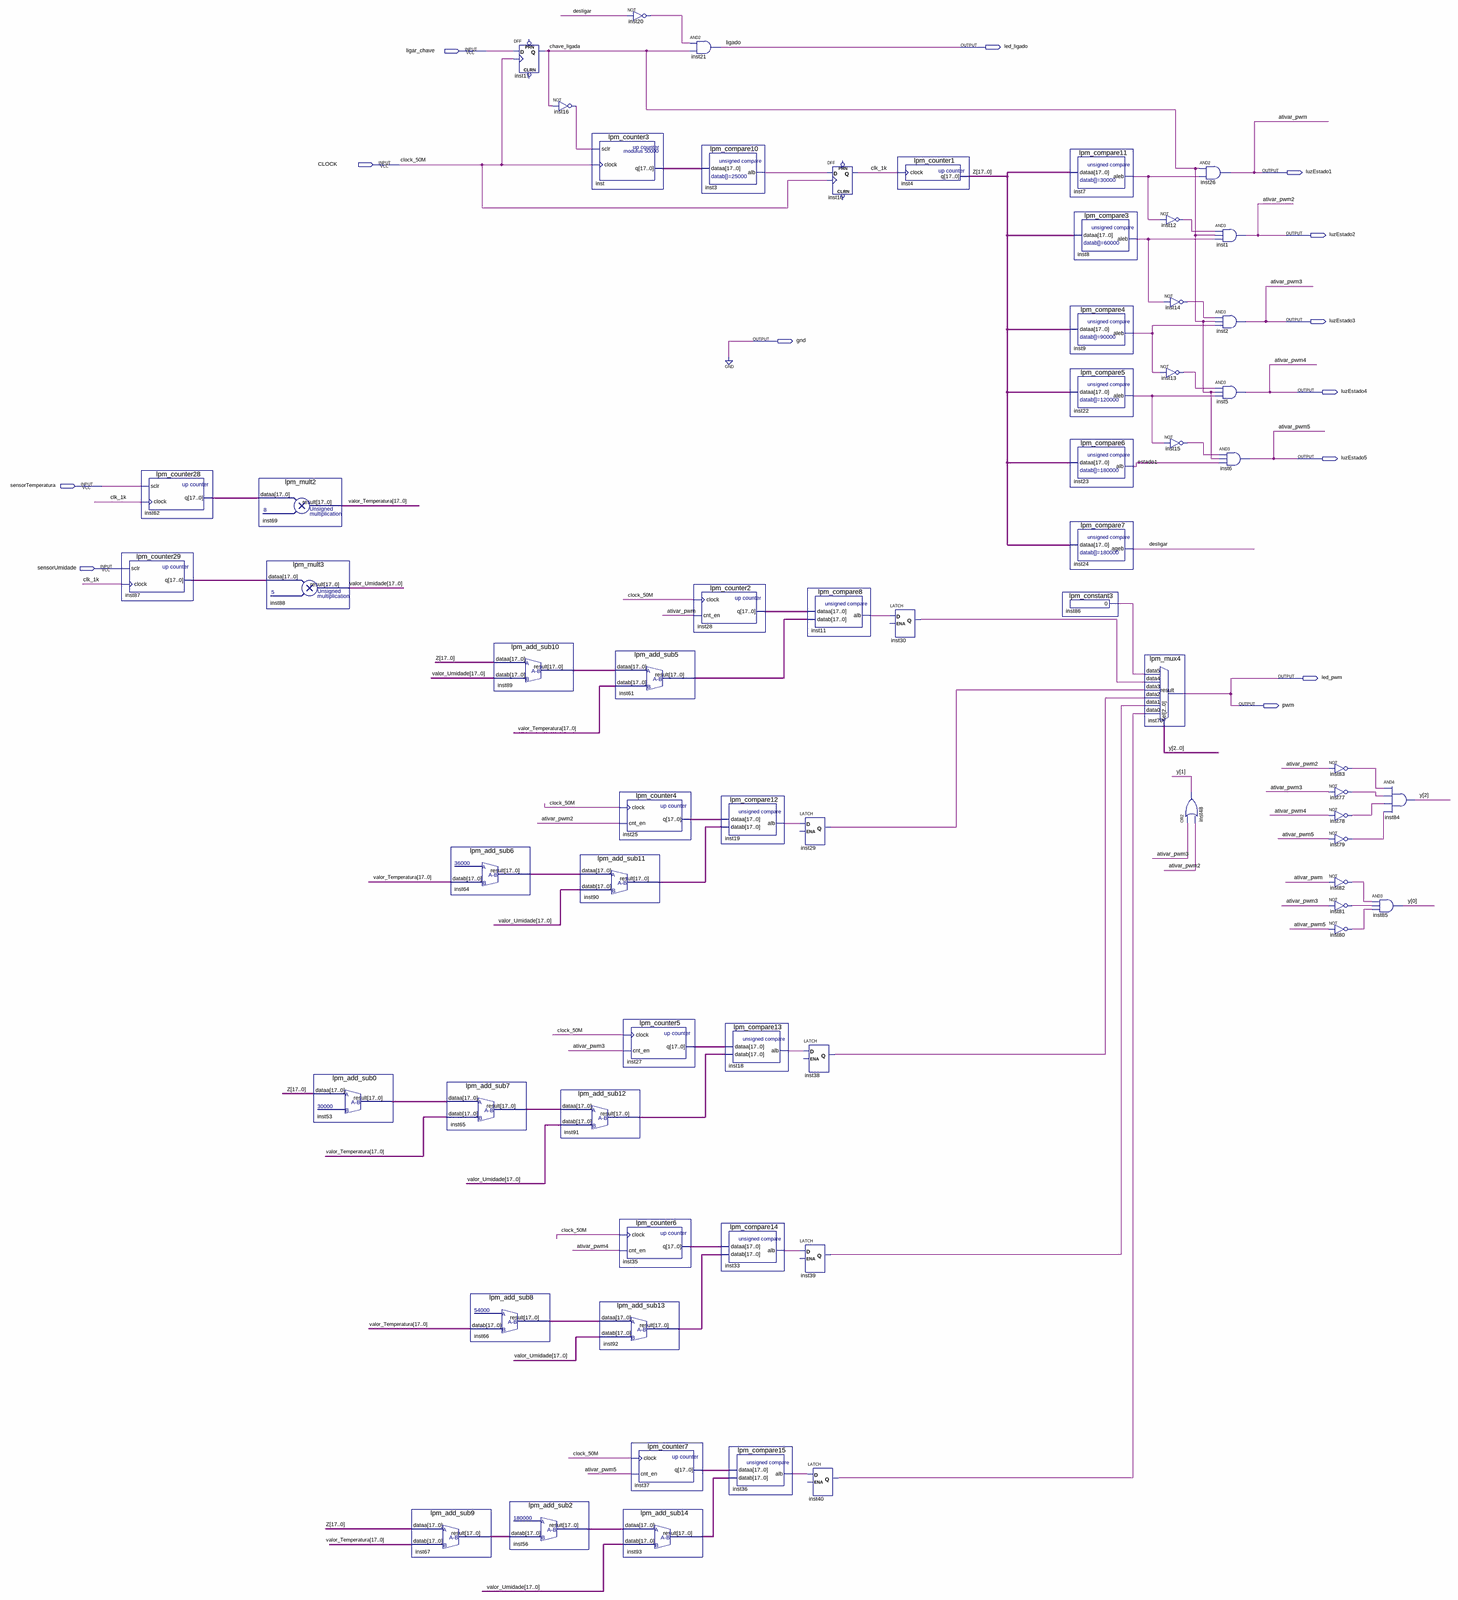
[diagram p0: schematic sheet, whole]
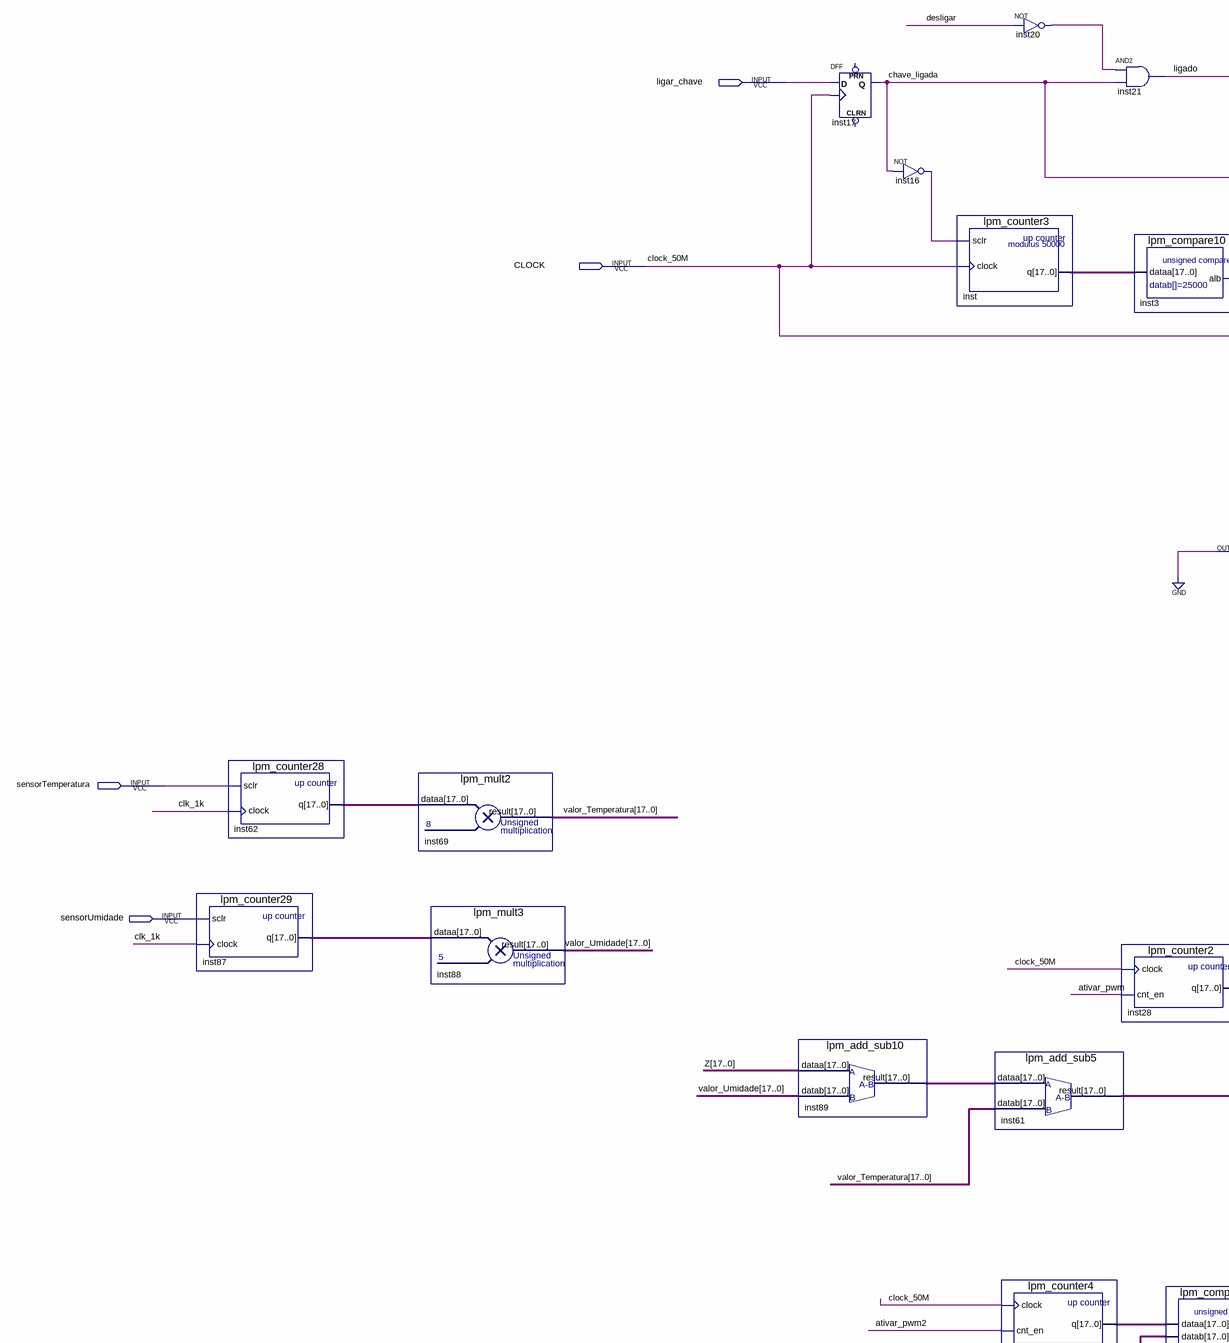
[diagram p1: schematic sheet, upper left part]
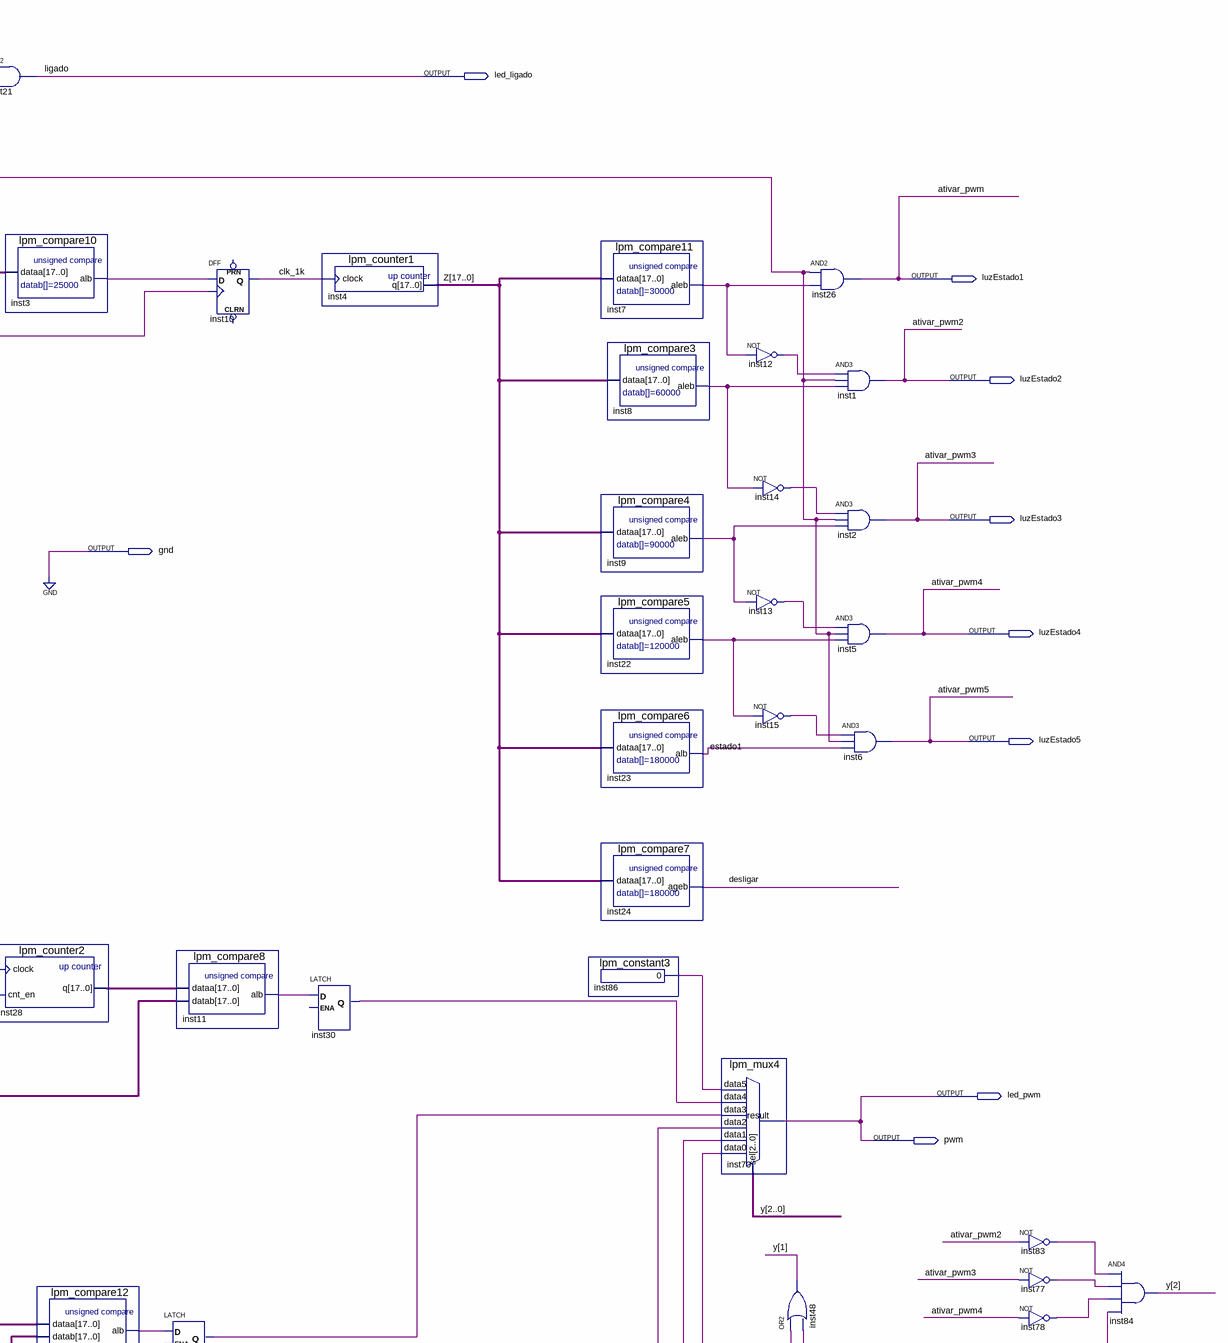
[diagram p2: schematic sheet, upper right part]
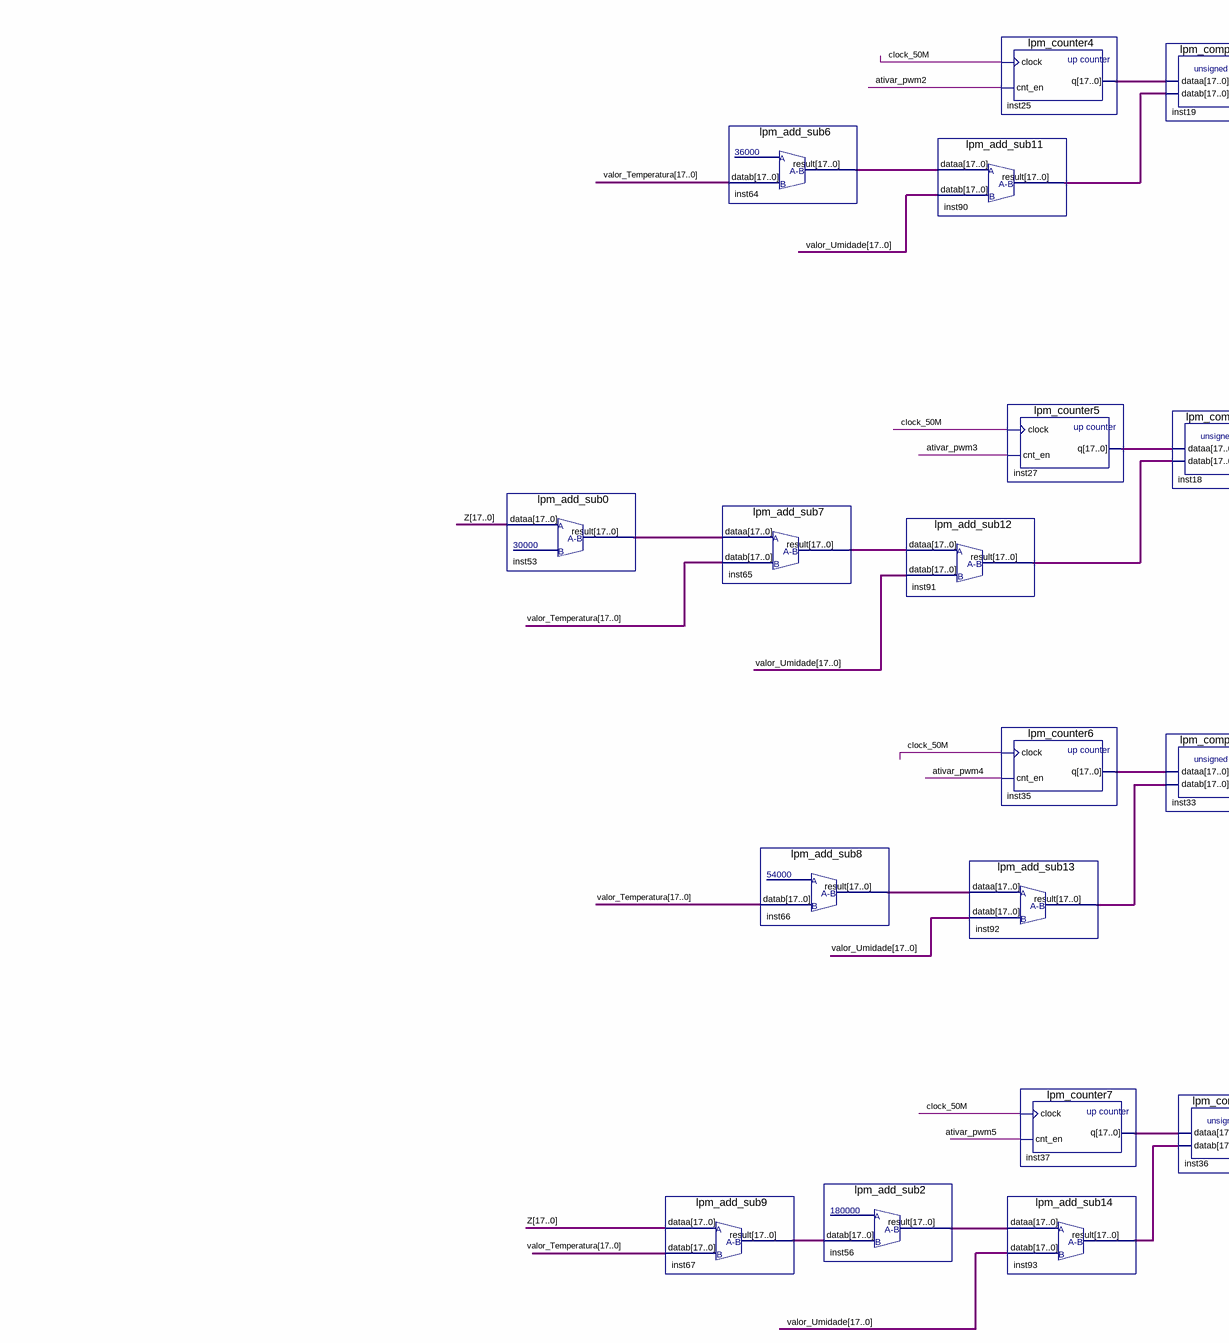
[diagram p3: schematic sheet, lower left part]
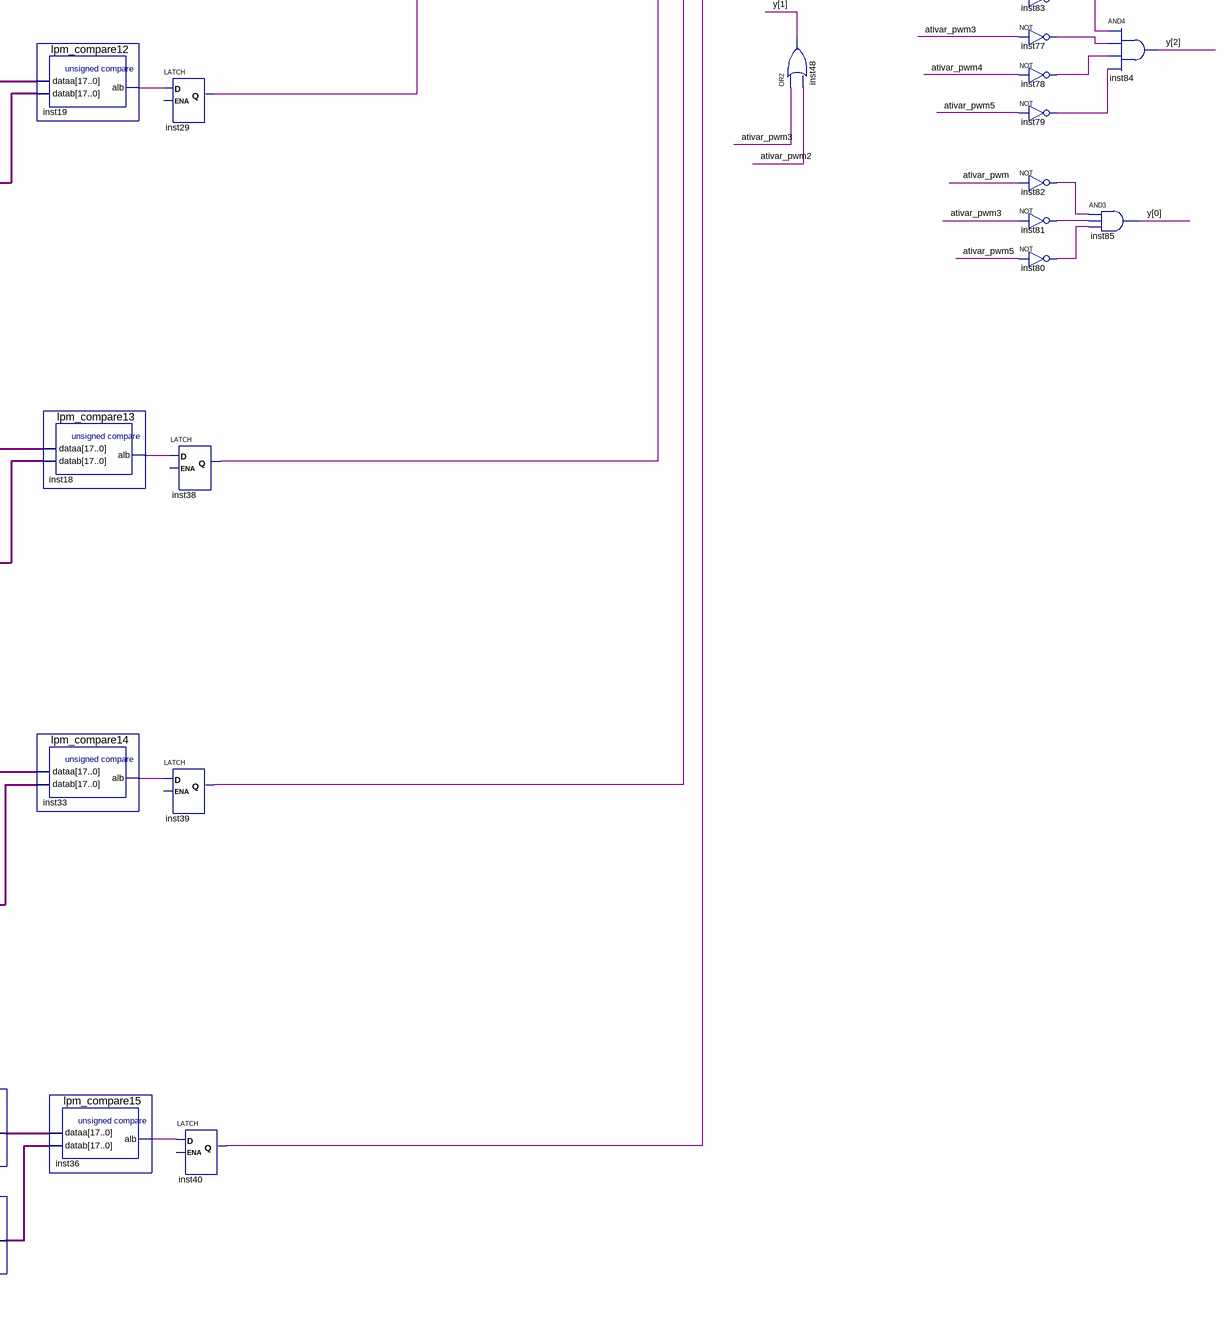
[diagram p4: schematic sheet, lower right part]
// Quartus schematic finalSDAtualizado1.bdf as structural Verilog: 66 symbols, 13 pins
module finalSDAtualizado1 (
  input  ligar_chave,
  input  CLOCK,
  input  sensorTemperatura,
  input  sensorUmidade,
  output led_ligado,
  output luzEstado1,
  output luzEstado2,
  output luzEstado3,
  output gnd,
  output luzEstado4,
  output luzEstado5,
  output led_pwm,
  output pwm
);

  wire chave_ligada, clk_1k, desligar, estado1, inst3_alb, inst7_aleb, inst8_aleb, inst9_aleb, inst11_alb,
       inst12_out, inst13_out, inst14_out, inst15_out, inst16_out, inst18_alb, inst19_alb, inst20_out,
       inst22_aleb, inst29_q, inst30_q, inst33_alb, inst36_alb, inst38_q, inst39_q, inst40_q, inst77_out,
       inst78_out, inst79_out, inst80_out, inst81_out, inst82_out, inst83_out, inst86_result;
  wire [2:0] y;
  wire [17:0] inst25_q, inst27_q, inst28_q, inst35_q, inst37_q, inst53_result, inst56_result, inst61_result,
       inst62_q, inst64_result, inst65_result, inst66_result, inst67_result, inst87_q, inst89_result,
       inst90_result, inst92_result, inst93_result, inst_q, valor_Temperatura, valor_Umidade, Z;

  lpm_counter29 inst87 (.sclr(sensorUmidade), .clock(clk_1k), .q(inst87_q));
  lpm_counter28 inst62 (.sclr(sensorTemperatura), .clock(clk_1k), .q(inst62_q));
  lpm_mult2 inst69 (.dataa(inst62_q), .result(valor_Temperatura));
  lpm_mult3 inst88 (.dataa(inst87_q), .result(valor_Umidade));
  lpm_add_sub0 inst53 (.dataa(Z), .result(inst53_result));
  lpm_add_sub9 inst67 (.dataa(Z), .datab(valor_Temperatura), .result(inst67_result));
  lpm_add_sub6 inst64 (.datab(valor_Temperatura), .result(inst64_result));
  lpm_add_sub7 inst65 (.dataa(inst53_result), .datab(valor_Temperatura), .result(inst65_result));
  lpm_add_sub8 inst66 (.datab(valor_Temperatura), .result(inst66_result));
  lpm_add_sub10 inst89 (.dataa(Z), .datab(valor_Umidade), .result(inst89_result));
  DFF inst17 (.CLK(CLOCK), .D(ligar_chave), .Q(chave_ligada));  // open: CLRN, PRN
  lpm_add_sub2 inst56 (.datab(inst67_result), .result(inst56_result));
  not inst16 (inst16_out, chave_ligada);
  lpm_add_sub12 inst91 (.dataa(inst65_result), .datab(valor_Umidade), .result(inst53_result));
  lpm_counter3 inst (.sclr(inst16_out), .clock(CLOCK), .q(inst_q));
  lpm_add_sub11 inst90 (.dataa(inst64_result), .datab(valor_Umidade), .result(inst90_result));
  lpm_add_sub13 inst92 (.dataa(inst66_result), .datab(valor_Umidade), .result(inst92_result));
  not inst20 (inst20_out, desligar);
  lpm_add_sub5 inst61 (.dataa(inst89_result), .datab(valor_Temperatura), .result(inst61_result));
  lpm_counter4 inst25 (.clock(CLOCK), .cnt_en(luzEstado2), .q(inst25_q));
  lpm_counter5 inst27 (.clock(CLOCK), .cnt_en(luzEstado3), .q(inst27_q));
  lpm_counter6 inst35 (.clock(CLOCK), .cnt_en(luzEstado4), .q(inst35_q));
  lpm_counter7 inst37 (.clock(CLOCK), .cnt_en(luzEstado5), .q(inst37_q));
  lpm_add_sub14 inst93 (.dataa(inst56_result), .datab(valor_Umidade), .result(inst93_result));
  and inst21 (led_ligado, inst20_out, chave_ligada);
  lpm_counter2 inst28 (.clock(CLOCK), .cnt_en(luzEstado1), .q(inst28_q));
  lpm_compare10 inst3 (.dataa(inst_q), .alb(inst3_alb));
  lpm_compare12 inst19 (.dataa(inst25_q), .datab(inst90_result), .alb(inst19_alb));
  lpm_compare13 inst18 (.dataa(inst27_q), .datab(inst53_result), .alb(inst18_alb));
  lpm_compare14 inst33 (.dataa(inst35_q), .datab(inst92_result), .alb(inst33_alb));
  lpm_compare15 inst36 (.dataa(inst37_q), .datab(inst93_result), .alb(inst36_alb));
  lpm_compare8 inst11 (.dataa(inst28_q), .datab(inst61_result), .alb(inst11_alb));
  LATCH inst29 (.D(inst19_alb), .Q(inst29_q));  // open: ENA
  LATCH inst38 (.D(inst18_alb), .Q(inst38_q));  // open: ENA
  LATCH inst39 (.D(inst33_alb), .Q(inst39_q));  // open: ENA
  LATCH inst40 (.D(inst36_alb), .Q(inst40_q));  // open: ENA
  DFF inst10 (.CLK(CLOCK), .D(inst3_alb), .Q(clk_1k));  // open: CLRN, PRN
  lpm_counter1 inst4 (.clock(clk_1k), .q(Z));
  LATCH inst30 (.D(inst11_alb), .Q(inst30_q));  // open: ENA
  lpm_compare11 inst7 (.dataa(Z), .aleb(inst7_aleb));
  lpm_compare4 inst9 (.dataa(Z), .aleb(inst9_aleb));
  lpm_compare5 inst22 (.dataa(Z), .aleb(inst22_aleb));
  lpm_compare6 inst23 (.dataa(Z), .alb(estado1));
  lpm_compare7 inst24 (.dataa(Z), .ageb(desligar));
  lpm_constant3 inst86 (.result(inst86_result));
  lpm_compare3 inst8 (.dataa(Z), .aleb(inst8_aleb));
  not inst12 (inst12_out, inst7_aleb);
  not inst14 (inst14_out, inst8_aleb);
  not inst13 (inst13_out, inst9_aleb);
  not inst15 (inst15_out, inst22_aleb);
  lpm_mux4 inst70 (
    .data5(inst86_result), .data4(inst30_q), .data3(inst29_q), .data2(inst38_q), .data1(inst39_q),
    .data0(inst40_q), .sel(y), .result(led_pwm));
  or inst48 (y[1], luzEstado3, luzEstado2);
  and inst26 (luzEstado1, chave_ligada, inst7_aleb);
  and inst1 (luzEstado2, inst12_out, chave_ligada, inst8_aleb);
  and inst2 (luzEstado3, inst14_out, chave_ligada, inst9_aleb);
  and inst5 (luzEstado4, inst13_out, chave_ligada, inst22_aleb);
  and inst6 (luzEstado5, inst15_out, chave_ligada, estado1);
  not inst83 (inst83_out, luzEstado2);
  not inst77 (inst77_out, luzEstado3);
  not inst78 (inst78_out, luzEstado4);
  not inst79 (inst79_out, luzEstado5);
  not inst82 (inst82_out, luzEstado1);
  not inst81 (inst81_out, luzEstado3);
  not inst80 (inst80_out, luzEstado5);
  and inst84 (y[2], inst83_out, inst77_out, inst78_out, inst79_out);
  and inst85 (y[0], inst82_out, inst81_out, inst80_out);

  assign gnd = 1'b0;
  assign pwm = led_pwm;

  // Other names for the same wires on the sheet: ativar_pwm2 = luzEstado2; ativar_pwm4 = luzEstado4;
  //   ativar_pwm5 = luzEstado5; clock_50M = CLOCK; ligado = led_ligado; ativar_pwm = luzEstado1;
  //   ativar_pwm3 = luzEstado3
endmodule
